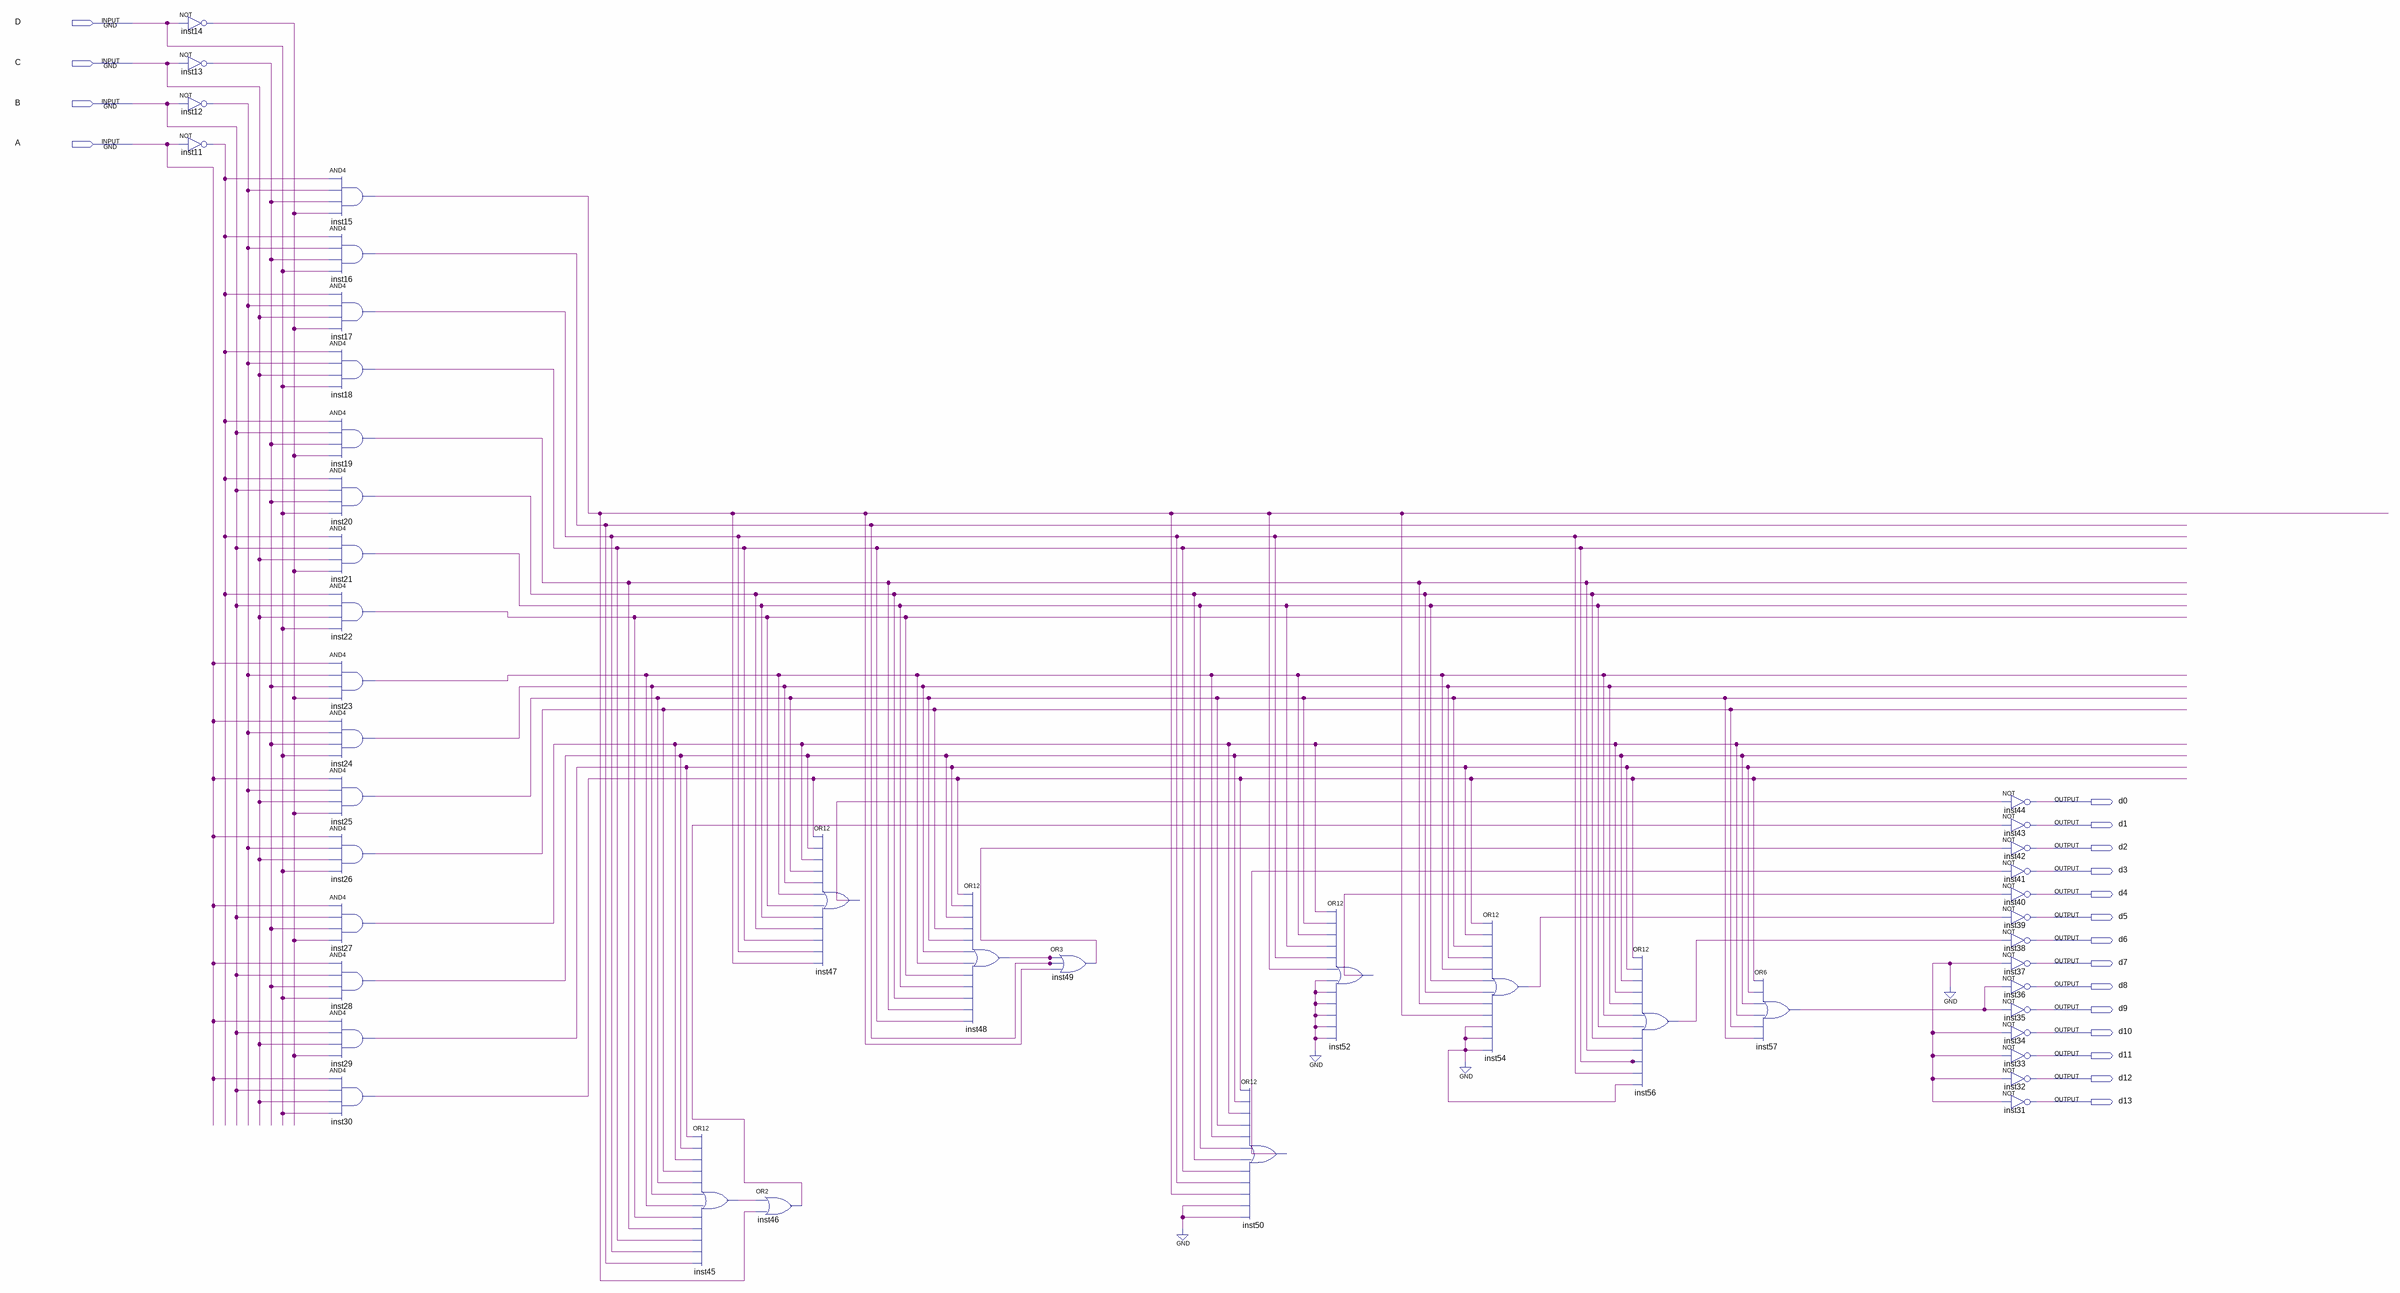
[diagram p0: schematic sheet]
// Quartus schematic group10.bdf as structural Verilog: 44 symbols, 18 pins
module group10 (
  input  D,
  input  C,
  input  B,
  input  A,
  output d0,
  output d1,
  output d2,
  output d3,
  output d4,
  output d5,
  output d6,
  output d7,
  output d8,
  output d9,
  output d10,
  output d11,
  output d12,
  output d13
);

  wire inst11_out, inst12_out, inst13_out, inst14_out, inst15_out, inst16_out, inst17_out, inst18_out,
       inst19_out, inst20_out, inst21_out, inst22_out, inst23_out, inst24_out, inst25_out, inst26_out,
       inst27_out, inst28_out, inst29_out, inst30_out, inst45_out, inst46_out, inst47_out, inst48_out,
       inst49_out, inst50_out, inst52_out, inst54_out, inst56_out, inst57_out;

  not inst14 (inst14_out, D);
  not inst13 (inst13_out, C);
  not inst12 (inst12_out, B);
  not inst11 (inst11_out, A);
  and inst15 (inst15_out, inst11_out, inst12_out, inst13_out, inst14_out);
  and inst16 (inst16_out, inst11_out, inst12_out, inst13_out, D);
  and inst17 (inst17_out, inst11_out, inst12_out, C, inst14_out);
  and inst18 (inst18_out, inst11_out, inst12_out, C, D);
  and inst19 (inst19_out, inst11_out, B, inst13_out, inst14_out);
  and inst20 (inst20_out, inst11_out, B, inst13_out, D);
  and inst21 (inst21_out, inst11_out, B, C, inst14_out);
  and inst22 (inst22_out, inst11_out, B, C, D);
  and inst23 (inst23_out, A, inst12_out, inst13_out, inst14_out);
  and inst24 (inst24_out, A, inst12_out, inst13_out, D);
  and inst25 (inst25_out, A, inst12_out, C, inst14_out);
  and inst26 (inst26_out, A, inst12_out, C, D);
  and inst27 (inst27_out, A, B, inst13_out, inst14_out);
  and inst28 (inst28_out, A, B, inst13_out, D);
  and inst29 (inst29_out, A, B, C, inst14_out);
  and inst30 (inst30_out, A, B, C, D);
  or inst45 (inst45_out, inst29_out, inst28_out, inst27_out, inst26_out, inst25_out, inst24_out, inst23_out, inst22_out, inst19_out, inst18_out, inst17_out, inst16_out);
  or inst46 (inst46_out, inst45_out, inst15_out);
  or inst47 (inst47_out, inst30_out, inst28_out, inst27_out, inst25_out, inst24_out, inst23_out, inst22_out, inst21_out, inst20_out, inst18_out, inst17_out, inst15_out);
  or inst48 (inst48_out, inst30_out, inst29_out, inst28_out, inst26_out, inst25_out, inst24_out, inst23_out, inst22_out, inst21_out, inst20_out, inst19_out, inst18_out);
  or inst49 (inst49_out, inst48_out, inst16_out, inst15_out);
  or inst50 (inst50_out, inst30_out, inst28_out, inst27_out, inst25_out, inst23_out, inst21_out, inst20_out, inst18_out, inst17_out, inst15_out, 1'b0, 1'b0);
  or inst52 (inst52_out, inst27_out, inst25_out, inst23_out, inst21_out, inst17_out, inst15_out, 1'b0, 1'b0, 1'b0, 1'b0, 1'b0, 1'b0);
  or inst54 (inst54_out, inst30_out, inst29_out, inst25_out, inst24_out, inst23_out, inst21_out, inst20_out, inst19_out, inst15_out, 1'b0, 1'b0, 1'b0);
  or inst56 (inst56_out, inst30_out, inst29_out, inst28_out, inst27_out, inst24_out, inst23_out, inst21_out, inst20_out, inst19_out, inst18_out, inst17_out, 1'b0);
  or inst57 (inst57_out, inst30_out, inst29_out, inst28_out, inst27_out, inst26_out, inst25_out);
  not inst44 (d0, inst47_out);
  not inst43 (d1, inst46_out);
  not inst42 (d2, inst49_out);
  not inst41 (d3, inst50_out);
  not inst40 (d4, inst52_out);
  not inst39 (d5, inst54_out);
  not inst38 (d6, inst56_out);
  not inst37 (d7, 1'b0);
  not inst36 (d8, inst57_out);
  not inst35 (d9, inst57_out);
  not inst34 (d10, 1'b0);
  not inst33 (d11, 1'b0);
  not inst32 (d12, 1'b0);
  not inst31 (d13, 1'b0);
endmodule
